# EAGLE schematic 7 Segment Display Peripheral (EAGLE 9.6.2)
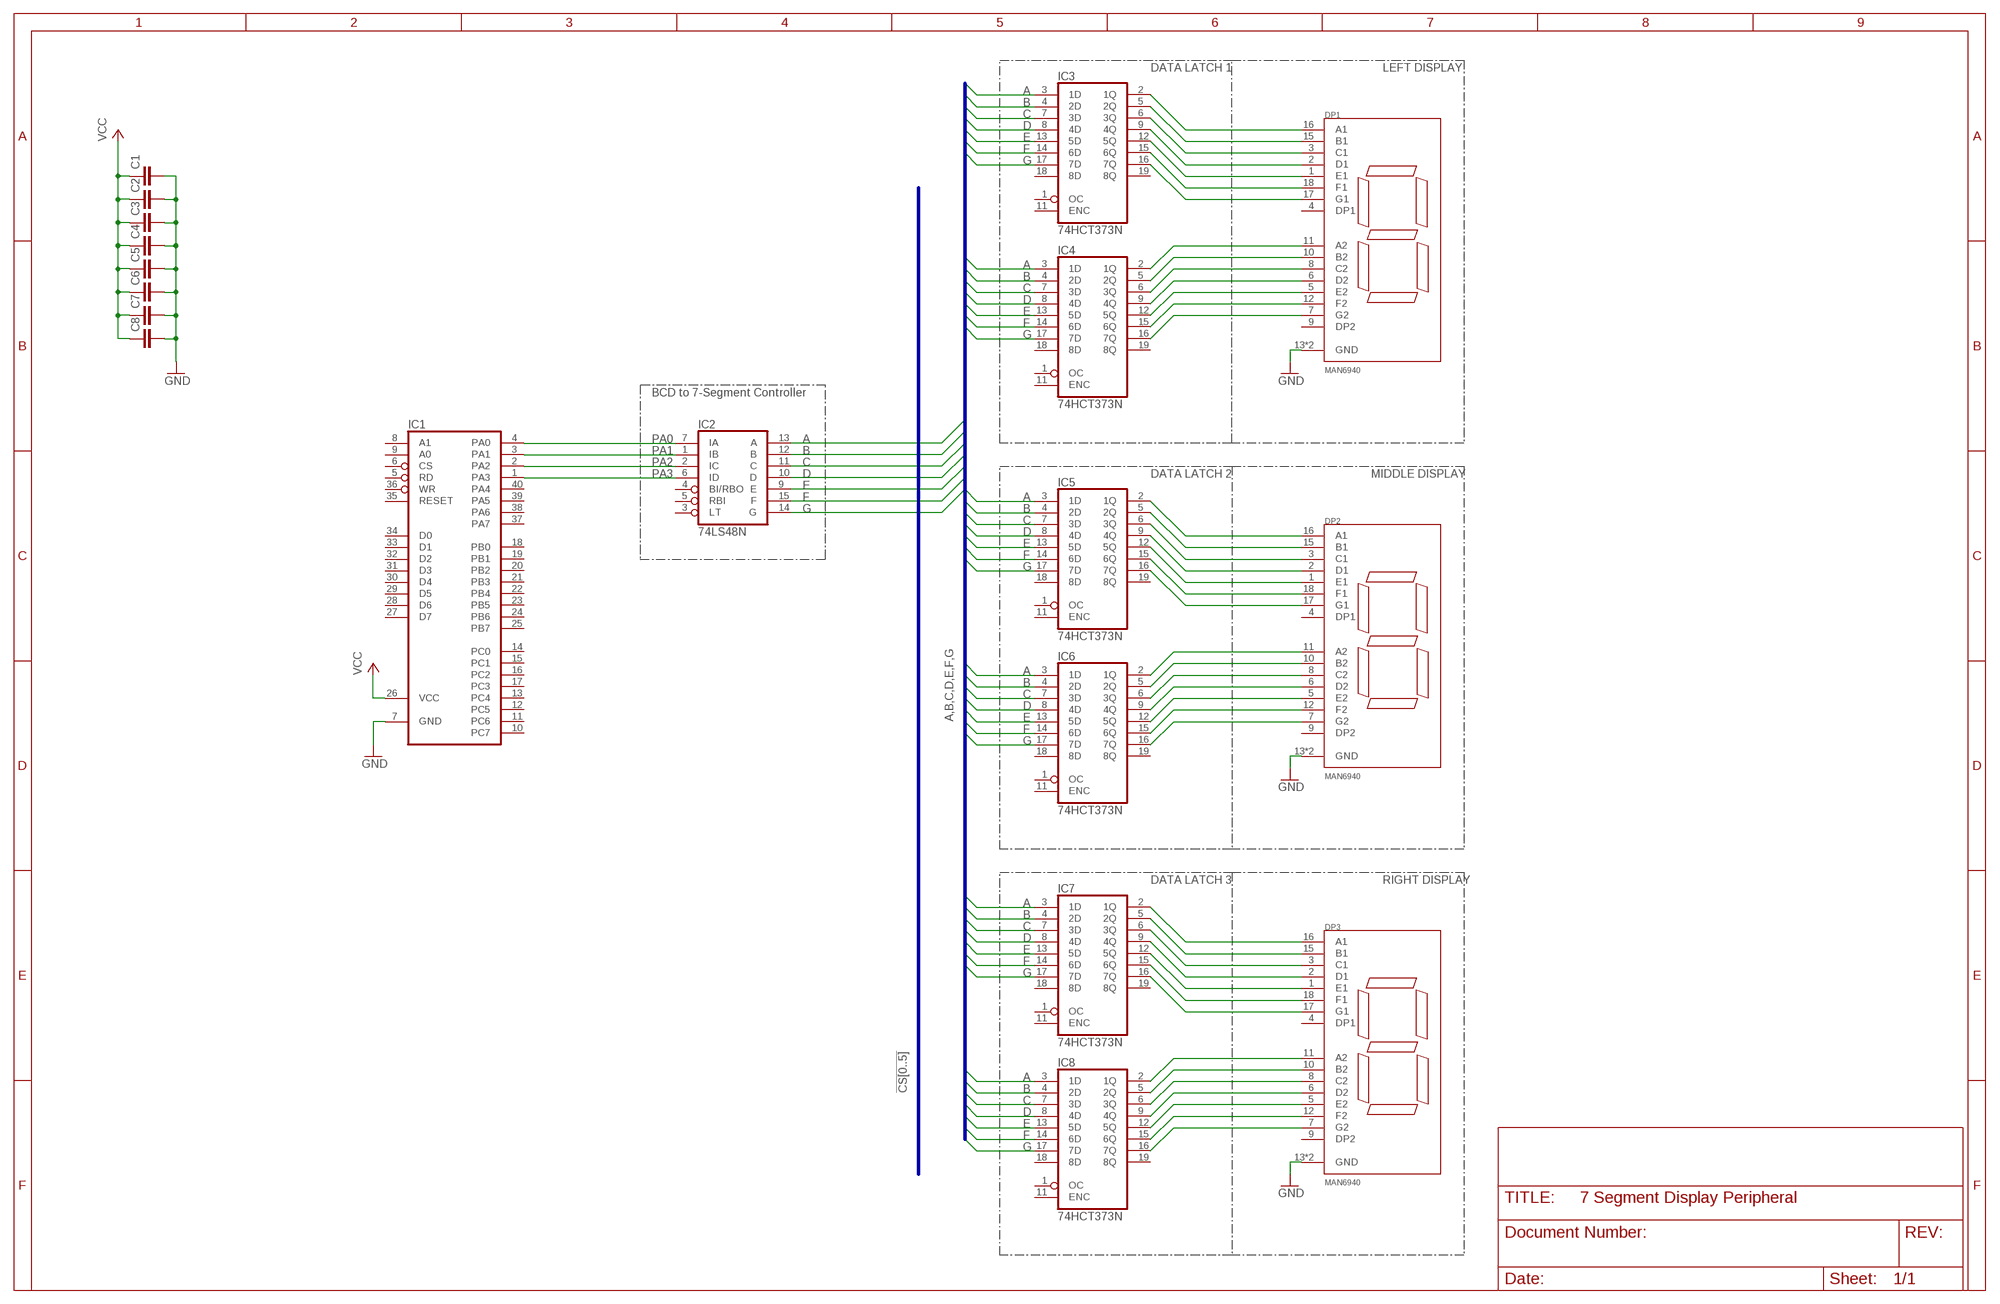
[diagram p0: schematic, sheet 1]

## Parts
C1  C-EU050-024X044  [C050-024X044]
C2  C-EU050-024X044  [C050-024X044]
C3  C-EU050-024X044  [C050-024X044]
C4  C-EU050-024X044  [C050-024X044]
C5  C-EU050-024X044  [C050-024X044]
C6  C-EU050-024X044  [C050-024X044]
C7  C-EU050-024X044  [C050-024X044]
C8  C-EU050-024X044  [C050-024X044]
DP1  MAN6940  [MAN6940]
DP2  MAN6940  [MAN6940]
DP3  MAN6940  [MAN6940]
IC1  82C55A  [DIL40]
IC2  74LS48N  [DIL16]
IC3  74HCT373N  [DIL20]
IC4  74HCT373N  [DIL20]
IC5  74HCT373N  [DIL20]
IC6  74HCT373N  [DIL20]
IC7  74HCT373N  [DIL20]
IC8  74HCT373N  [DIL20]

## Nets
A: IC2.13(A) IC3.3(1D) IC4.3(1D) IC5.3(1D) IC6.3(1D) IC7.3(1D) IC8.3(1D)
B: IC2.12(B) IC3.4(2D) IC4.4(2D) IC5.4(2D) IC6.4(2D) IC7.4(2D) IC8.4(2D)
C: IC2.11(C) IC3.7(3D) IC4.7(3D) IC5.7(3D) IC6.7(3D) IC7.7(3D) IC8.7(3D)
D: IC2.10(D) IC3.8(4D) IC4.8(4D) IC5.8(4D) IC6.8(4D) IC7.8(4D) IC8.8(4D)
E: IC2.9(E) IC3.13(5D) IC4.13(5D) IC5.13(5D) IC6.13(5D) IC7.13(5D) IC8.13(5D)
F: IC2.15(F) IC3.14(6D) IC4.14(6D) IC5.14(6D) IC6.14(6D) IC7.14(6D) IC8.14(6D)
G: IC2.14(G) IC3.17(7D) IC4.17(7D) IC5.17(7D) IC6.17(7D) IC7.17(7D) IC8.17(7D)
GND: C1.2 C2.2 C3.2 C4.2 C5.2 C6.2 C7.2 C8.2 DP1.13(GND) DP1.14(GND) DP2.13(GND) DP2.14(GND) DP3.13(GND) DP3.14(GND) IC1.7(GND)
N$1: DP1.17(G1) IC3.16(7Q)
N$2: DP1.18(F1) IC3.15(6Q)
N$3: DP1.1(E1) IC3.12(5Q)
N$4: DP1.2(D1) IC3.9(4Q)
N$5: DP1.3(C1) IC3.6(3Q)
N$6: DP1.15(B1) IC3.5(2Q)
N$7: DP1.16(A1) IC3.2(1Q)
N$8: DP1.11(A2) IC4.2(1Q)
N$9: DP1.10(B2) IC4.5(2Q)
N$10: DP1.8(C2) IC4.6(3Q)
N$11: DP1.6(D2) IC4.9(4Q)
N$12: DP1.5(E2) IC4.12(5Q)
N$13: DP1.12(F2) IC4.15(6Q)
N$14: DP1.7(G2) IC4.16(7Q)
N$43: DP2.17(G1) IC5.16(7Q)
N$44: DP2.18(F1) IC5.15(6Q)
N$45: DP2.1(E1) IC5.12(5Q)
N$46: DP2.2(D1) IC5.9(4Q)
N$47: DP2.3(C1) IC5.6(3Q)
N$48: DP2.15(B1) IC5.5(2Q)
N$49: DP2.16(A1) IC5.2(1Q)
N$50: DP2.11(A2) IC6.2(1Q)
N$51: DP2.10(B2) IC6.5(2Q)
N$52: DP2.8(C2) IC6.6(3Q)
N$53: DP2.6(D2) IC6.9(4Q)
N$54: DP2.5(E2) IC6.12(5Q)
N$55: DP2.12(F2) IC6.15(6Q)
N$56: DP2.7(G2) IC6.16(7Q)
N$57: DP3.17(G1) IC7.16(7Q)
N$58: DP3.18(F1) IC7.15(6Q)
N$59: DP3.1(E1) IC7.12(5Q)
N$60: DP3.2(D1) IC7.9(4Q)
N$61: DP3.3(C1) IC7.6(3Q)
N$62: DP3.15(B1) IC7.5(2Q)
N$63: DP3.16(A1) IC7.2(1Q)
N$64: DP3.11(A2) IC8.2(1Q)
N$65: DP3.10(B2) IC8.5(2Q)
N$66: DP3.8(C2) IC8.6(3Q)
N$67: DP3.6(D2) IC8.9(4Q)
N$68: DP3.5(E2) IC8.12(5Q)
N$69: DP3.12(F2) IC8.15(6Q)
N$70: DP3.7(G2) IC8.16(7Q)
PA0: IC1.4(PA0) IC2.7(IA)
PA1: IC1.3(PA1) IC2.1(IB)
PA2: IC1.2(PA2) IC2.2(IC)
PA3: IC1.1(PA3) IC2.6(ID)
VCC: C1.1 C2.1 C3.1 C4.1 C5.1 C6.1 C7.1 C8.1 IC1.26(VCC)
Unconnected: DP1.4(DP1) DP1.9(DP2) DP2.4(DP1) DP2.9(DP2) DP3.4(DP1) DP3.9(DP2) IC1.5(RD) IC1.6(CS) IC1.8(A1) IC1.9(A0) IC1.10(PC7) IC1.11(PC6) IC1.12(PC5) IC1.13(PC4) IC1.14(PC0) IC1.15(PC1) IC1.16(PC2) IC1.17(PC3) IC1.18(PB0) IC1.19(PB1) IC1.20(PB2) IC1.21(PB3) IC1.22(PB4) IC1.23(PB5) IC1.24(PB6) IC1.25(PB7) IC1.27(D7) IC1.28(D6) IC1.29(D5) IC1.30(D4) IC1.31(D3) IC1.32(D2) IC1.33(D1) IC1.34(D0) IC1.35(RESET) IC1.36(WR) IC1.37(PA7) IC1.38(PA6) IC1.39(PA5) IC1.40(PA4) IC2.3(LT) IC2.4(BI/RBO) IC2.5(RBI) IC3.1(OC) IC3.11(ENC) IC3.18(8D) IC3.19(8Q) IC4.1(OC) IC4.11(ENC) IC4.18(8D) IC4.19(8Q) IC5.1(OC) IC5.11(ENC) IC5.18(8D) IC5.19(8Q) IC6.1(OC) IC6.11(ENC) IC6.18(8D) IC6.19(8Q) IC7.1(OC) IC7.11(ENC) IC7.18(8D) IC7.19(8Q) IC8.1(OC) IC8.11(ENC) IC8.18(8D) IC8.19(8Q)

## Buses
A,B,C,D,E,F,G
!CS[0..5]

## Notes on the sheet
- DATA LATCH 1 | LEFT DISPLAY
- BCD to 7-Segment Controller
- DATA LATCH 2 | MIDDLE DISPLAY
- DATA LATCH 3 | RIGHT DISPLAY

## Power pins joined to a net without a drawn wire
GND: IC2.8(GND) IC3.10(GND) IC4.10(GND) IC5.10(GND) IC6.10(GND) IC7.10(GND) IC8.10(GND)
VCC: IC2.16(VCC) IC3.20(VCC) IC4.20(VCC) IC5.20(VCC) IC6.20(VCC) IC7.20(VCC) IC8.20(VCC)

## Library data of the parts
C1-C8 = rcl:C-EU: CAPACITOR, European symbol; SPICEPREFIX: C
DP1-DP3 = MAN6940:MAN6940: FAIRCHILD SEMICONDUCTOR: MAN6940 Double 7-Segment Display (Common Cathode)
IC1 = micro-intel:82C55A: MICROCOMPUTER/PERIPHERAL DEVICE; MF: INTERSIL; MPN: IP82C55AZ; OC_FARNELL: 1562050; OC_NEWARK: 79K6939
IC2 = 74xx-us:74*48: BCD to seven segment DECODER/DRIVER
IC3-IC8 = 74xx-eu:74*373: Octal D type transparent LATCH, edge triggered